# Altium schematic sheet Simple Converter.SchDoc
size A; SheetNumber: 1; SheetTotal: 1
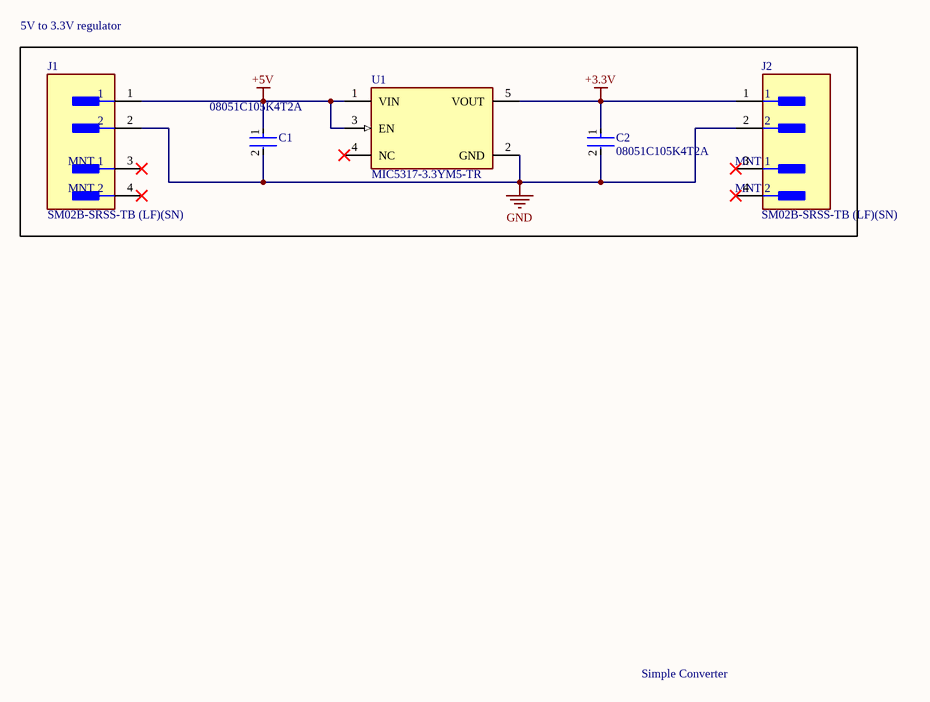
[diagram p0: Simple Converter.SchDoc]

## Parts
C1  08051C105K4T2A  [FP-0805-L_2_01_0_2-W_1_25-MFG]
C2  08051C105K4T2A  [FP-0805-L_2_01_0_2-W_1_25-MFG]
J1  SM02B-SRSS-TB (LF)(SN)  [FP-SM02B-SRSS-TB_LF_SN-MFG]
J2  SM02B-SRSS-TB (LF)(SN)  [FP-SM02B-SRSS-TB_LF_SN-MFG]
U1  MIC5317-3.3YM5-TR  [FP-SOT23-5LD-PL-1-MFG]

## Blocks framed on the sheet
5V to 3.3V regulator: C1 C2 J1 J2 U1

## Nets
+3.3V: C2.1 J2.1 U1.5(VOUT)
+5V: C1.1 J1.1 U1.1(VIN) U1.3(EN)
GND: C1.2 C2.2 J1.2 J2.2 U1.2(GND)

Not connected (* = marked no-connect by the designer): J1 3(MNT_1)* 4(MNT_2)*; J2 3(MNT_1)* 4(MNT_2)*; U1 4(NC)*

## Notes on the sheet
- Simple Converter

## Library data of the parts
C1 C2 = CMP-07738-122049624-1: 08051C105K4T2A Cap Ceramic 1uF 100V X7R 10% Pad SMD 0805 125C Automotive T/R; Capacitance: 1µF; Tolerance: 10%; Dielectric: X7R; Case/Package: 0805; Material: Ceramic; Height: 1.4mm; Voltage Rating (DC): 100V; Voltage Rating: 100V; Schedule B: 8532240020; NexarPartId: 122049624; RoHS: Compliant; Lifecycle Status: Production; Min Operating Temperature: -55°C; Max Operating Temperature: 125°C
J1 J2 = CMP-17439-000368-1: CONN HEADER SMD R/A 2POS 1MM; Max Current Rating: 1A; Voltage Rating (AC): 50V; Current Rating: 700mA; Contact Resistance: 40mR; Number of Positions: 2; Insulation Resistance: 100MR; Fastening Type: Pull; Orientation: Right Angle; Insulation Color: Natural; Insulation Material: Nylon; Connector Type: Header; Contact Type: Male Pin; Number of Rows: 1; Housing Material: Polyamide; Contact Material: Copper Alloy; Mount: Surface Mount; Packaging: Tape and Reel; Lead Pitch: 1mm; REACH SVHC: No SVHC; Flammability Rating: UL94 V-0; Termination: Solder; Series: SR; Length: 4mm; Color: Natural; Min Operating Temperature: -25°C; Pitch: 1mm; Depth: 4.95mm; Contact Plating: Tin; Lead Free: Lead Free; Max Operating Temperature: 85°C; Contact Finish - Mating: TIN; Material: Polyamide; Voltage Rating: 50V; Max Voltage Rating (AC): 50V; Housing Color: Beige; Contact Shape: Square; Number of Contacts: 2
U1 = CMP-06324-000116-1: IC REG LINEAR 3.3V 150MA SOT23-5; Max Input Voltage: 6V; Number of Regulators: 1; Min Current Limit: 200mA; Dropout Voltage: 155mV; Min Input Voltage: 2.5V; Power Supply Rejection Ratio (PSRR): 70dB; Case/Package: SOT-23-5; Output Voltage: 3.3V; Series: -; Max Operating Temperature: 125°C; Package Quantity: 3000; Mount: Surface Mount; Packaging: Tape and Reel; RoHS Compliant: No; Output Current: 150mA; Min Operating Temperature: -40°C; Number of Outputs: 1